# EAGLE schematic schematic (EAGLE 8.3.1)
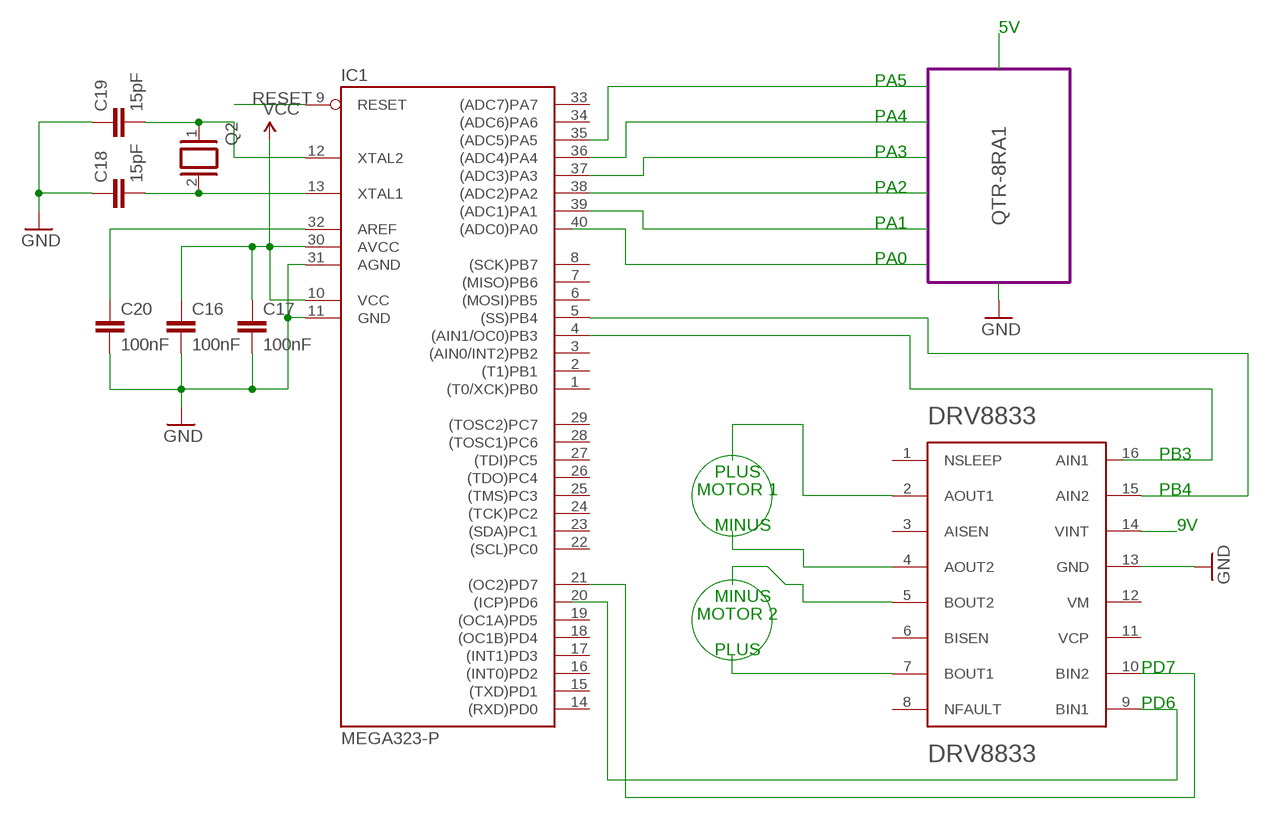
[diagram p0: schematic, sheet 1]

## Parts
C16  100nF  C-EUC_PM  [C025-025X050]
C17  100nF  C-EUC_PM  [C025-025X050]
C18  15pF  C-EUC_PM  [C025-025X050]
C19  15pF  C-EUC_PM  [C025-025X050]
C20  100nF  C-EUC_PM  [C025-025X050]
DRV8833PWP1  DRV8833  [SOP65P640X120-17N]
IC1  MEGA323-P  [DIL40]
Q2  XTAL/S  [QS]

## Module instances
QTR-8RA1 = QTR-8RA

## Nets
GND: C16.2 C17.2 C18.1 C19.1 C20.2 DRV8833PWP1.13(GND)
N$1: IC1.4((AIN1/OC0)PB3)
N$2: DRV8833PWP1.9(BIN1)
N$3: DRV8833PWP1.2(AOUT1)
N$4: DRV8833PWP1.4(AOUT2)
N$5: DRV8833PWP1.5(BOUT2)
N$6: DRV8833PWP1.7(BOUT1)
N$7: DRV8833PWP1.10(BIN2) IC1.21((OC2)PD7)
N$8: DRV8833PWP1.14(VINT)
N$9: IC1.35((ADC5)PA5)
N$10: IC1.36((ADC4)PA4)
N$11: IC1.37((ADC3)PA3)
N$12: IC1.38((ADC2)PA2)
N$13: IC1.39((ADC1)PA1)
N$15: C20.1
N$16: C18.2 Q2.2
N$17: C19.2 Q2.1
N$19: DRV8833PWP1.15(AIN2) IC1.5((SS)PB4)
VCC: C16.1 C17.1
Unconnected: DRV8833PWP1.1(NSLEEP) DRV8833PWP1.3(AISEN) DRV8833PWP1.6(BISEN) DRV8833PWP1.8(NFAULT) DRV8833PWP1.11(VCP) DRV8833PWP1.12(VM) DRV8833PWP1.16(AIN1) IC1.1((T0/XCK)PB0) IC1.2((T1)PB1) IC1.3((AIN0/INT2)PB2) IC1.6((MOSI)PB5) IC1.7((MISO)PB6) IC1.8((SCK)PB7) IC1.9(RESET) IC1.12(XTAL2) IC1.13(XTAL1) IC1.14((RXD)PD0) IC1.15((TXD)PD1) IC1.16((INT0)PD2) IC1.17((INT1)PD3) IC1.18((OC1B)PD4) IC1.19((OC1A)PD5) IC1.20((ICP)PD6) IC1.22((SCL)PC0) IC1.23((SDA)PC1) IC1.24((TCK)PC2) IC1.25((TMS)PC3) IC1.26((TDO)PC4) IC1.27((TDI)PC5) IC1.28((TOSC1)PC6) IC1.29((TOSC2)PC7) IC1.32(AREF) IC1.33((ADC7)PA7) IC1.34((ADC6)PA6) IC1.40((ADC0)PA0)

## Notes on the sheet
- 5V
- PA5
- PA4
- PA3
- PA2
- PA1
- PA0
- PB3
- PLUS
- MOTOR 1 | PB4
- MINUS | 9V
- MINUS
- MOTOR 2
- PLUS
- PD7
- PD6

## Power pins joined to a net without a drawn wire
AGND: IC1.31(AGND)
AVCC: IC1.30(AVCC)
GND: IC1.11(GND)
VCC: IC1.10(VCC)

## Library data of the parts
C16-C20 = 0andrei_custom:C-EU: CAPACITOR, European symbol
DRV8833PWP1 = DRV8833PWP:DRV8833
IC1 = atmel:MEGA323-P: MICROCONTROLLER 32 Kbytes FLASH 2 Kbytes SRAM 1 Kbytes EEPROM USART 8-channel 10 bit ADC Source: avr.lbr; OC_FARNELL: unknown; OC_NEWARK: unknown
Q2 = special:XTAL/S: CRYSTAL

## Module QTR-8RA
Ports: 

### Library data of the parts